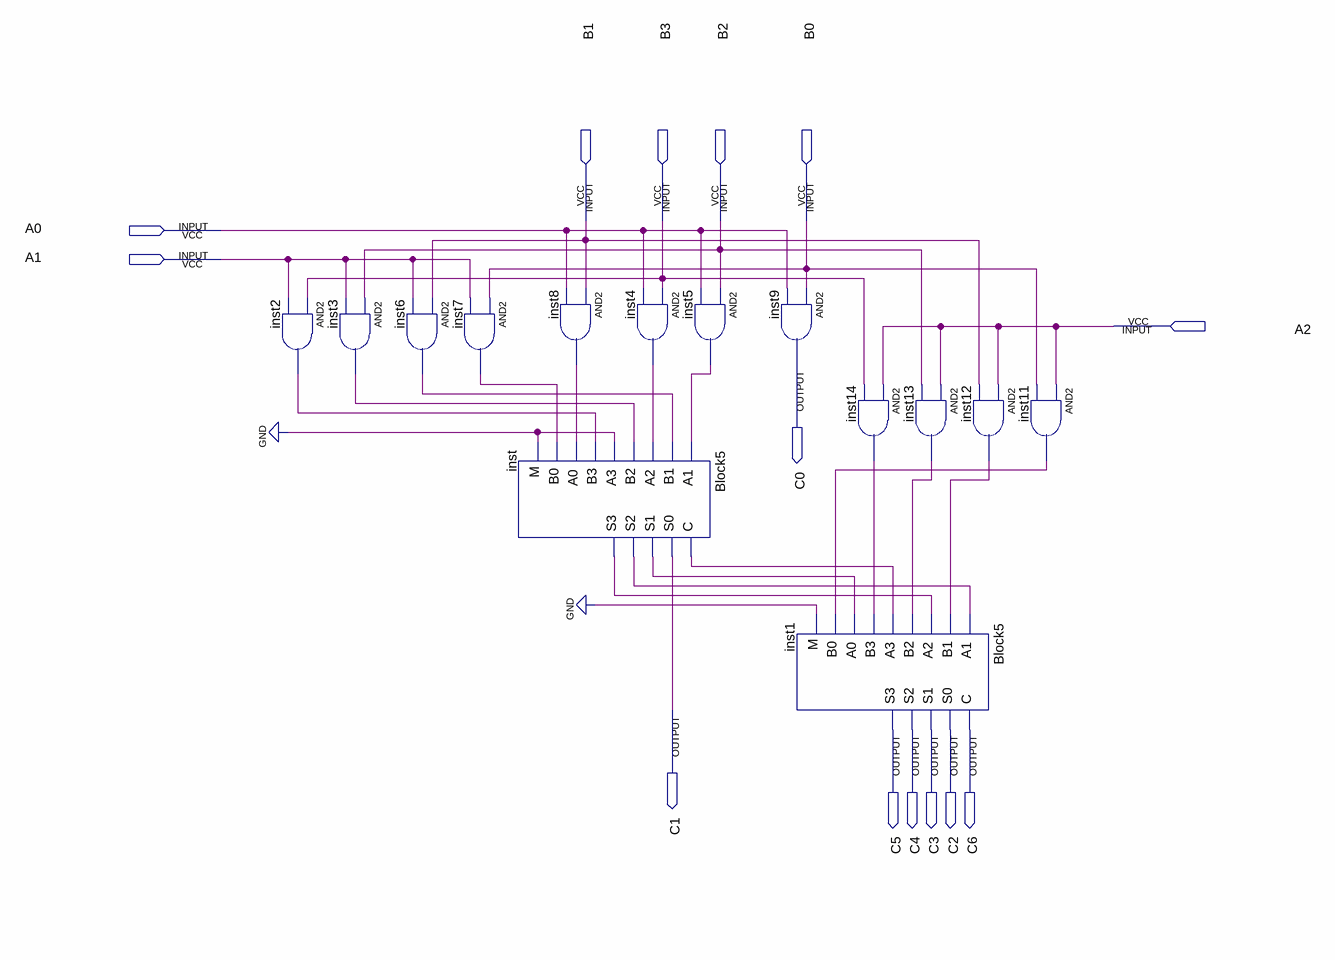
[diagram p0: schematic sheet]
// Quartus schematic lab03_2.bdf as structural Verilog: 14 symbols, 14 pins
module lab03_2 (
  input  B1,
  input  B3,
  input  B2,
  input  B0,
  input  A0,
  input  A1,
  input  A2,
  output C0,
  output C1,
  output C5,
  output C4,
  output C3,
  output C2,
  output C6
);

  wire inst2_out, inst3_out, inst4_out, inst5_out, inst6_out, inst7_out, inst8_out, inst11_out, inst12_out,
       inst13_out, inst14_out, inst_c, inst_s1, inst_s2, inst_s3;

  and inst2 (inst2_out, B3, A1);
  and inst3 (inst3_out, B2, A1);
  and inst6 (inst6_out, B1, A1);
  and inst7 (inst7_out, B0, A1);
  Block5 inst (
    .A1(inst5_out), .B1(inst6_out), .A2(inst4_out), .B2(inst3_out), .A3(1'b0), .B3(inst2_out),
    .A0(inst8_out), .B0(inst7_out), .M(1'b0), .C(inst_c), .S0(C1), .S1(inst_s1), .S2(inst_s2), .S3(inst_s3));
  and inst8 (inst8_out, B1, A0);
  and inst4 (inst4_out, B3, A0);
  and inst5 (inst5_out, B2, A0);
  and inst9 (C0, B0, A0);
  Block5 inst1 (
    .A1(inst_s2), .B1(inst12_out), .A2(inst_s3), .B2(inst13_out), .A3(inst_c), .B3(inst14_out), .A0(inst_s1),
    .B0(inst11_out), .M(1'b0), .C(C6), .S0(C2), .S1(C3), .S2(C4), .S3(C5));
  and inst14 (inst14_out, A2, B3);
  and inst12 (inst12_out, A2, B1);
  and inst13 (inst13_out, A2, B2);
  and inst11 (inst11_out, A2, B0);
endmodule
